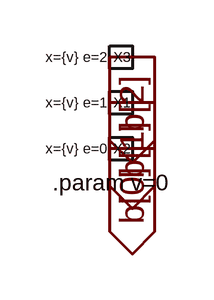
[diagram p0: schematic val-3bit.asc]
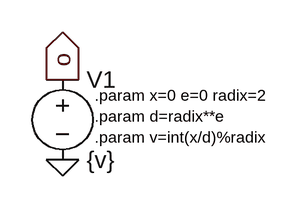
[diagram p1: sub-circuit bit-extract.asc]
val-3bit.asc, the LTspice schematic file:
Version 4
SHEET 1 880 680
FLAG 96 176 b[0]
IOPIN 96 176 Out
FLAG 96 144 b[1]
IOPIN 96 144 Out
FLAG 96 112 b[2]
IOPIN 96 112 Out
SYMBOL bit-extract 80 144 R0
WINDOW 0 9 0 Center 0
WINDOW 39 -2 0 Right 0
SYMATTR InstName X1
SYMATTR SpiceLine x={v} e=1
SYMBOL bit-extract 80 176 R0
WINDOW 0 9 0 Center 0
WINDOW 39 -2 0 Right 0
SYMATTR InstName X2
SYMATTR SpiceLine x={v} e=0
SYMBOL bit-extract 80 112 R0
WINDOW 0 9 0 Center 0
WINDOW 39 -2 0 Right 0
SYMATTR InstName X3
SYMATTR SpiceLine x={v} e=2
TEXT 40 200 Left 1 !.param v=0

bit-extract.asc, the sub-circuit schematic file:
Version 4
SHEET 1 880 680
FLAG 112 208 0
FLAG 112 128 o
IOPIN 112 128 Out
SYMBOL voltage 112 112 R0
SYMATTR InstName V1
SYMATTR Value {v}
TEXT 144 144 Left 1 !.param x=0 e=0 radix=2\n.param d=radix**e\n.param v=int(x/d)%radix

The netlist it stands for:
* val-3bit.asc
XX1 b[1] bit-extract params: x={v} e=1
XX2 b[0] bit-extract params: x={v} e=0
XX3 b[2] bit-extract params: x={v} e=2

* block symbol definitions
.subckt bit-extract o
V1 o 0 {v}
.param x=0 e=0 radix=2
.param d=radix**e
.param v=int(x/d)%radix
.ends bit-extract

.param v=0
.backanno
.end